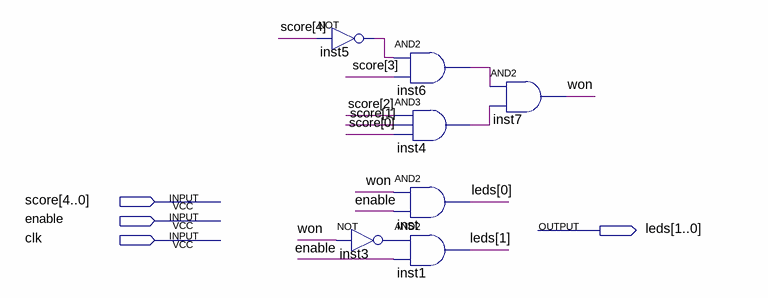
[diagram p0: schematic sheet]
// Quartus schematic End.bdf as structural Verilog: 7 symbols, 4 pins
module End (
  input  [4:0] score,
  input  enable,
  input  clk,
  output [1:0] leds
);

  wire inst3_out, inst4_out, inst5_out, inst6_out, won;

  not inst5 (inst5_out, score[4]);
  not inst3 (inst3_out, won);
  and inst6 (inst6_out, inst5_out, score[3]);
  and inst4 (inst4_out, score[2], score[1], score[0]);
  and inst (leds[0], won, enable);
  and inst1 (leds[1], inst3_out, enable);
  and inst7 (won, inst6_out, inst4_out);
endmodule
